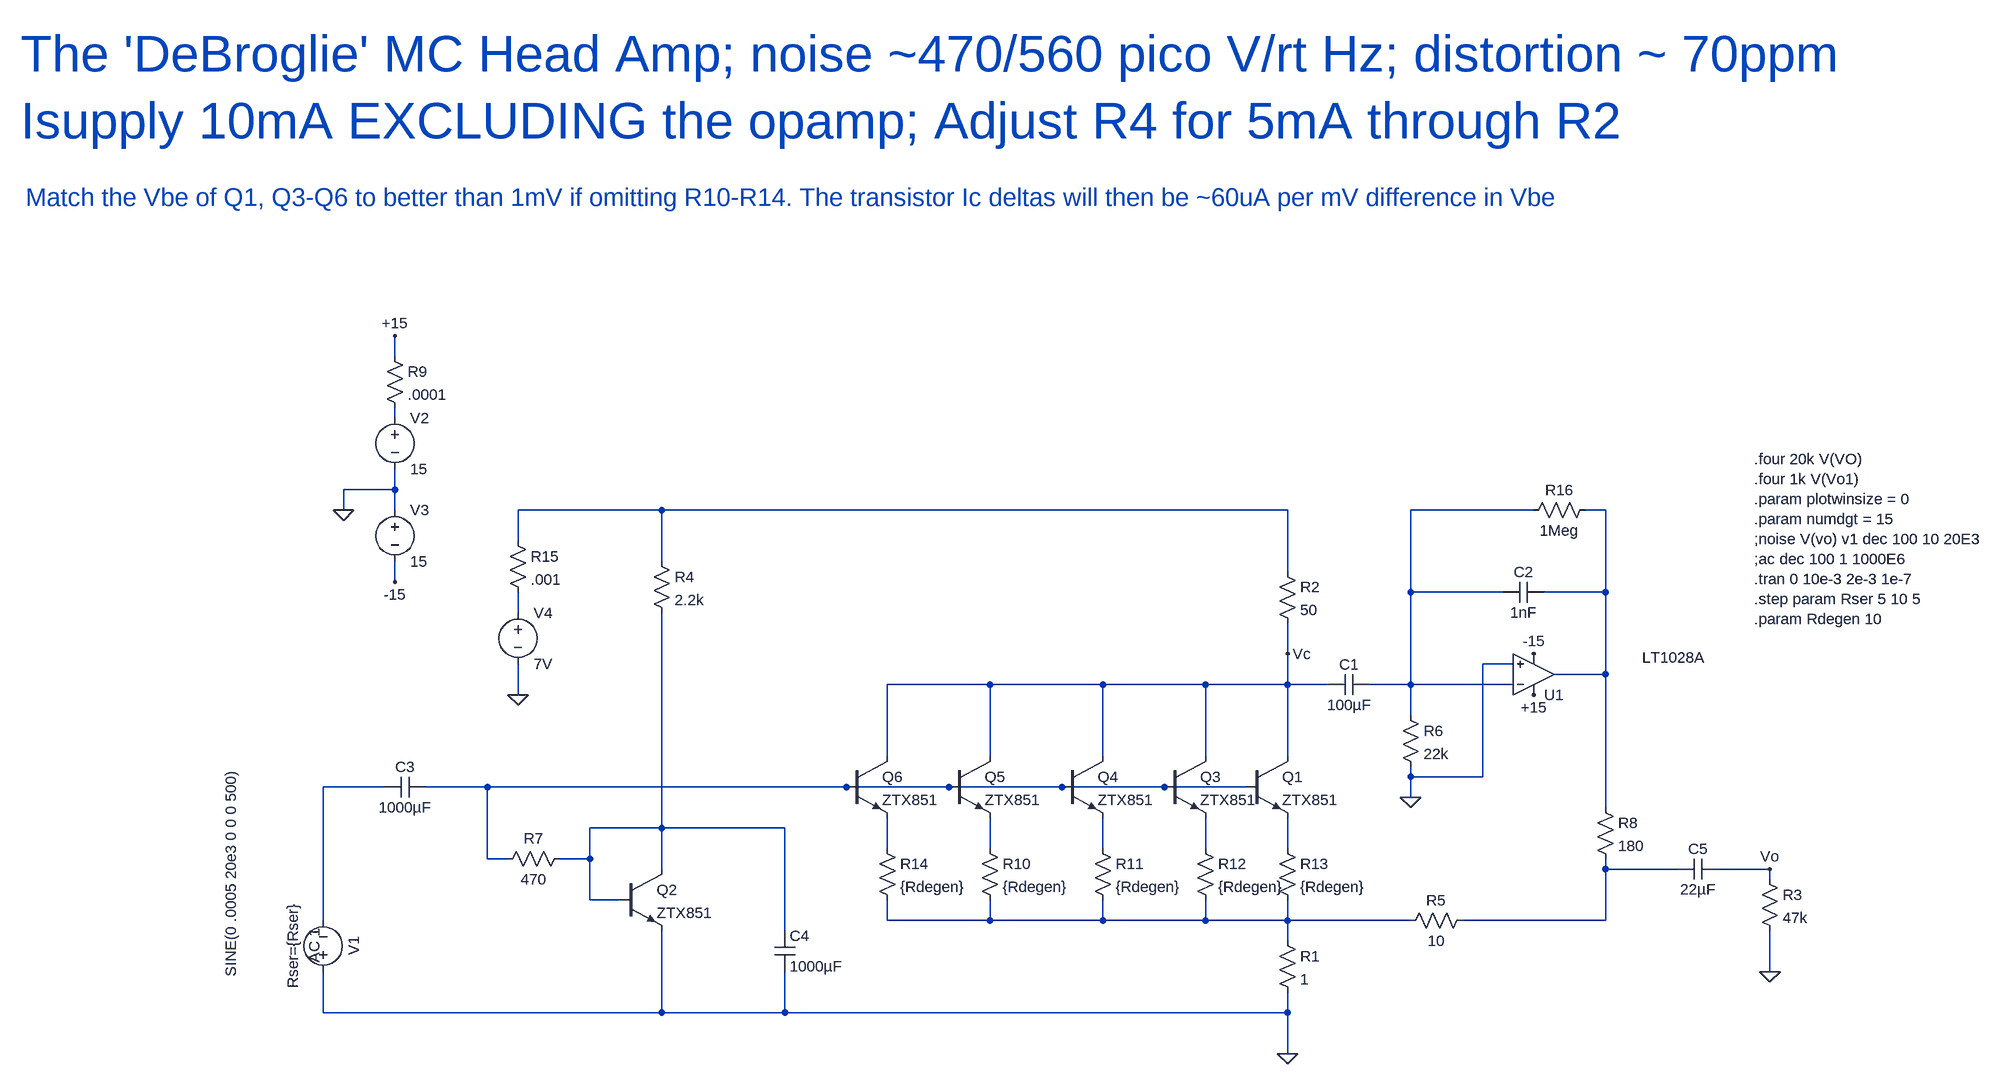
[diagram p0: schematic DeBroglie.asc]
DeBroglie.asc, the LTspice schematic file:
Version 4
SHEET 1 2444 680
WIRE -624 -496 -624 -528
WIRE -624 -400 -624 -416
WIRE -624 -288 -624 -320
WIRE -624 -288 -704 -288
WIRE -704 -256 -704 -288
WIRE -624 -256 -624 -288
WIRE -208 -256 -432 -256
WIRE 768 -256 -208 -256
WIRE 1152 -256 960 -256
WIRE 1264 -256 1232 -256
WIRE -432 -208 -432 -256
WIRE -208 -176 -208 -256
WIRE 768 -160 768 -256
WIRE -624 -144 -624 -176
WIRE 960 -128 960 -256
WIRE 1104 -128 960 -128
WIRE 1264 -128 1264 -256
WIRE 1264 -128 1168 -128
WIRE -432 -96 -432 -128
WIRE 768 -32 768 -80
WIRE 1120 -16 1072 -16
WIRE 1264 0 1264 -128
WIRE 1264 0 1184 0
WIRE 304 16 144 16
WIRE 480 16 304 16
WIRE 640 16 480 16
WIRE 768 16 768 -32
WIRE 768 16 640 16
WIRE 832 16 768 16
WIRE 960 16 960 -128
WIRE 960 16 896 16
WIRE 1120 16 960 16
WIRE -432 32 -432 -16
WIRE 960 64 960 16
WIRE 144 128 144 16
WIRE 304 128 304 16
WIRE 480 128 480 16
WIRE 640 128 640 16
WIRE 768 128 768 16
WIRE 960 160 960 144
WIRE 1072 160 1072 -16
WIRE 1072 160 960 160
WIRE -640 176 -736 176
WIRE -480 176 -576 176
WIRE 80 176 -480 176
WIRE 240 176 80 176
WIRE 416 176 240 176
WIRE 576 176 416 176
WIRE 704 176 576 176
WIRE 960 192 960 160
WIRE 1264 208 1264 0
WIRE -208 240 -208 -96
WIRE -208 240 -320 240
WIRE -16 240 -208 240
WIRE 144 272 144 224
WIRE 304 272 304 224
WIRE 480 272 480 224
WIRE 640 272 640 224
WIRE 768 272 768 224
WIRE -480 288 -480 176
WIRE -448 288 -480 288
WIRE -320 288 -320 240
WIRE -320 288 -368 288
WIRE -208 304 -208 240
WIRE 1264 304 1264 288
WIRE 1376 304 1264 304
WIRE 1520 304 1440 304
WIRE 1520 320 1520 304
WIRE -320 352 -320 288
WIRE -272 352 -320 352
WIRE -736 384 -736 176
WIRE 144 384 144 352
WIRE 304 384 304 352
WIRE 304 384 144 384
WIRE 480 384 480 352
WIRE 480 384 304 384
WIRE 640 384 640 352
WIRE 640 384 480 384
WIRE 768 384 768 352
WIRE 768 384 640 384
WIRE 960 384 768 384
WIRE 1264 384 1264 304
WIRE 1264 384 1040 384
WIRE -16 400 -16 240
WIRE 768 416 768 384
WIRE 1520 464 1520 400
WIRE -736 528 -736 464
WIRE -208 528 -208 400
WIRE -208 528 -736 528
WIRE -16 528 -16 464
WIRE -16 528 -208 528
WIRE 768 528 768 496
WIRE 768 528 -16 528
WIRE 768 592 768 528
FLAG 768 592 0
FLAG -704 -256 0
FLAG -624 -528 +15
FLAG -624 -144 -15
FLAG 1152 32 +15
FLAG 1152 -32 -15
FLAG 960 192 0
FLAG -432 32 0
FLAG 768 -32 Vc
FLAG 1520 464 0
FLAG 1520 304 Vo
SYMBOL npn 704 128 R0
SYMATTR InstName Q1
SYMATTR Value ZTX851
SYMBOL res 752 400 R0
SYMATTR InstName R1
SYMATTR Value 1
SYMBOL res 752 -176 R0
SYMATTR InstName R2
SYMATTR Value 50
SYMBOL voltage -736 480 R180
WINDOW 0 -32 56 VBottom 2
WINDOW 3 160 168 VBottom 2
WINDOW 123 -2 56 VTop 2
WINDOW 39 32 56 VTop 2
SYMATTR InstName V1
SYMATTR Value SINE(0 .0005 20e3 0 0 0 500)
SYMATTR Value2 AC 1
SYMATTR SpiceLine Rser={Rser}
SYMBOL voltage -624 -416 R0
WINDOW 123 0 0 Left 2
WINDOW 39 0 0 Left 2
SYMATTR InstName V2
SYMATTR Value 15
SYMBOL voltage -624 -272 R0
WINDOW 123 0 0 Left 2
WINDOW 39 0 0 Left 2
SYMATTR InstName V3
SYMATTR Value 15
SYMBOL Opamps\\LT1028A 1152 64 M180
WINDOW 3 169 90 Left 2
SYMATTR InstName U1
SYMBOL res 1056 368 R90
WINDOW 0 0 56 VBottom 2
WINDOW 3 32 56 VTop 2
SYMATTR InstName R5
SYMATTR Value 10
SYMBOL cap 896 0 R90
WINDOW 0 0 32 VBottom 2
WINDOW 3 32 32 VTop 2
SYMATTR InstName C1
SYMATTR Value 100µF
SYMBOL res 944 48 R0
SYMATTR InstName R6
SYMATTR Value 22k
SYMBOL voltage -432 -112 R0
WINDOW 123 0 0 Left 2
WINDOW 39 0 0 Left 2
SYMATTR InstName V4
SYMATTR Value 7V
SYMBOL cap -576 160 R90
WINDOW 0 0 32 VBottom 2
WINDOW 3 32 32 VTop 2
SYMATTR InstName C3
SYMATTR Value 1000µF
SYMBOL cap 1168 -144 R90
WINDOW 0 0 32 VBottom 2
WINDOW 3 32 32 VTop 2
SYMATTR InstName C2
SYMATTR Value 1nF
SYMBOL npn -272 304 R0
SYMATTR InstName Q2
SYMATTR Value ZTX851
SYMBOL res -224 -192 R0
SYMATTR InstName R4
SYMATTR Value 2.2k
SYMBOL res -352 272 R90
WINDOW 0 0 56 VBottom 2
WINDOW 3 32 56 VTop 2
SYMATTR InstName R7
SYMATTR Value 470
SYMBOL cap -32 400 R0
SYMATTR InstName C4
SYMATTR Value 1000µF
SYMBOL cap 1440 288 R90
WINDOW 0 0 32 VBottom 2
WINDOW 3 32 32 VTop 2
SYMATTR InstName C5
SYMATTR Value 22µF
SYMBOL res 1504 304 R0
SYMATTR InstName R3
SYMATTR Value 47k
SYMBOL res 1248 192 R0
SYMATTR InstName R8
SYMATTR Value 180
SYMBOL npn 576 128 R0
SYMATTR InstName Q3
SYMATTR Value ZTX851
SYMBOL npn 416 128 R0
SYMATTR InstName Q4
SYMATTR Value ZTX851
SYMBOL res -640 -512 R0
SYMATTR InstName R9
SYMATTR Value .0001
SYMBOL npn 240 128 R0
SYMATTR InstName Q5
SYMATTR Value ZTX851
SYMBOL npn 80 128 R0
SYMATTR InstName Q6
SYMATTR Value ZTX851
SYMBOL res 128 256 R0
SYMATTR InstName R14
SYMATTR Value {Rdegen}
SYMBOL res -448 -224 R0
SYMATTR InstName R15
SYMATTR Value .001
SYMBOL res 1248 -272 R90
WINDOW 0 0 56 VBottom 2
WINDOW 3 32 56 VTop 2
SYMATTR InstName R16
SYMATTR Value 1Meg
SYMBOL res 288 256 R0
SYMATTR InstName R10
SYMATTR Value {Rdegen}
SYMBOL res 464 256 R0
SYMATTR InstName R11
SYMATTR Value {Rdegen}
SYMBOL res 624 256 R0
SYMATTR InstName R12
SYMATTR Value {Rdegen}
SYMBOL res 752 256 R0
SYMATTR InstName R13
SYMATTR Value {Rdegen}
TEXT 1496 -336 Left 2 !.four 20k V(VO)\n.four 1k V(Vo1)\n.param plotwinsize = 0\n.param numdgt = 15\n;noise V(vo) v1 dec 100 10 20E3\n;ac dec 100 1 1000E6\n.tran 0 10e-3 2e-3 1e-7\n.step param Rser 5 10 5\n.param Rdegen 10
TEXT -1208 -968 Left 6 ;The 'DeBroglie' MC Head Amp; noise ~470/560 pico V/rt Hz; distortion ~ 70ppm\nIsupply 10mA EXCLUDING the opamp; Adjust R4 for 5mA through R2
TEXT -1200 -744 Left 4 ;Match the Vbe of Q1, Q3-Q6 to better than 1mV if omitting R10-R14. The transistor Ic deltas will then be ~60uA per mV difference in Vbe

The netlist it stands for:
* DeBroglie.asc
Q1 Vc N007 N013 0 ZTX851
R1 N015 0 1
R2 N002 Vc 50
V1 0 N006 SINE(0 .0005 20e3 0 0 0 500) AC 1 Rser={Rser}
V2 N001 0 15
V3 0 -15 15
XU1 0 N003 +15 -15 N004 LT1028A  ; pins In+ In- V+ V- OUT
R5 N014 N015 10
C1 N003 Vc 100µF
R6 N003 0 22k
V4 N005 0 7V
C3 N007 N006 1000µF
C2 N004 N003 1nF
Q2 N008 N008 0 0 ZTX851
R4 N002 N008 2.2k
R7 N008 N007 470
C4 N008 0 1000µF
C5 Vo N014 22µF
R3 Vo 0 47k
R8 N004 N014 180
Q3 Vc N007 N012 0 ZTX851
Q4 Vc N007 N011 0 ZTX851
R9 +15 N001 .0001
Q5 Vc N007 N010 0 ZTX851
Q6 Vc N007 N009 0 ZTX851
R14 N009 N015 {Rdegen}
R15 N002 N005 .001
R16 N004 N003 1Meg
R10 N010 N015 {Rdegen}
R11 N011 N015 {Rdegen}
R12 N012 N015 {Rdegen}
R13 N013 N015 {Rdegen}
.model NPN NPN
.model PNP PNP
.lib standard.bjt
.four 20k V(VO)
.four 1k V(Vo1)
.param plotwinsize = 0
.param numdgt = 15
;noise V(vo) v1 dec 100 10 20E3
;ac dec 100 1 1000E6
.tran 0 10e-3 2e-3 1e-7
.step param Rser 5 10 5
.param Rdegen 10
* The 'DeBroglie' MC Head Amp; noise ~470/560 pico V/rt Hz; distortion ~ 70ppm
* Isupply 10mA EXCLUDING the opamp; Adjust R4 for 5mA through R2
* Match the Vbe of Q1, Q3-Q6 to better than 1mV if omitting R10-R14. The transistor Ic deltas will then be ~60uA per mV difference in Vbe
.backanno
.end